# Altium schematic sheet low-pass-filter.SchDoc
size A4; SheetNumber: 8; SheetTotal: 8
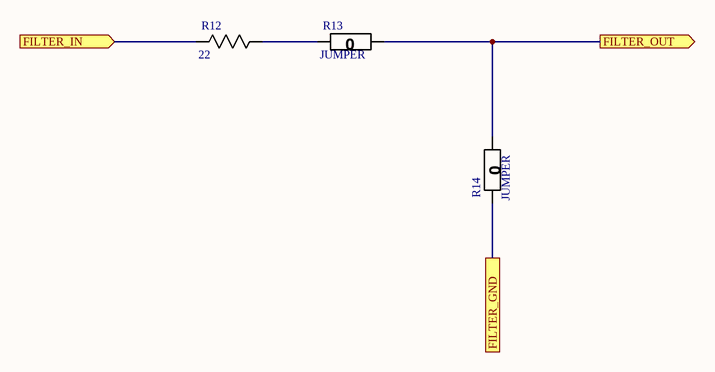
[diagram p0: low-pass-filter.SchDoc]

## Parts
R12  22  [0805]
R13  JUMPER  [0805]
R14  JUMPER  [0805]

## Ports
FILTER_GND, FILTER_IN (in), FILTER_OUT (out)

## Nets
FILTER_GND: R14.2(R2) ; port FILTER_GND
FILTER_IN: R12.2(R2) ; port FILTER_IN
FILTER_OUT: R13.1(R1) R14.1(R1) ; port FILTER_OUT
NetR12_1: R12.1(R1) R13.2(R2)

## Library data of the parts
R12 = RES 22.0 1/8W: RES SMD 22 OHM 5% 1/8W 0805; Power (Watts): 0.125W; Package: 0805; Value: 22; Tolerance: 5%
R13 R14 = RES 0 JUMPER: RES SMD 0 OHM JUMPER GENERIC 0805; Value: 0; Package: 0805